# EAGLE design Papilio-VGA_Wing (EAGLE 6.4)
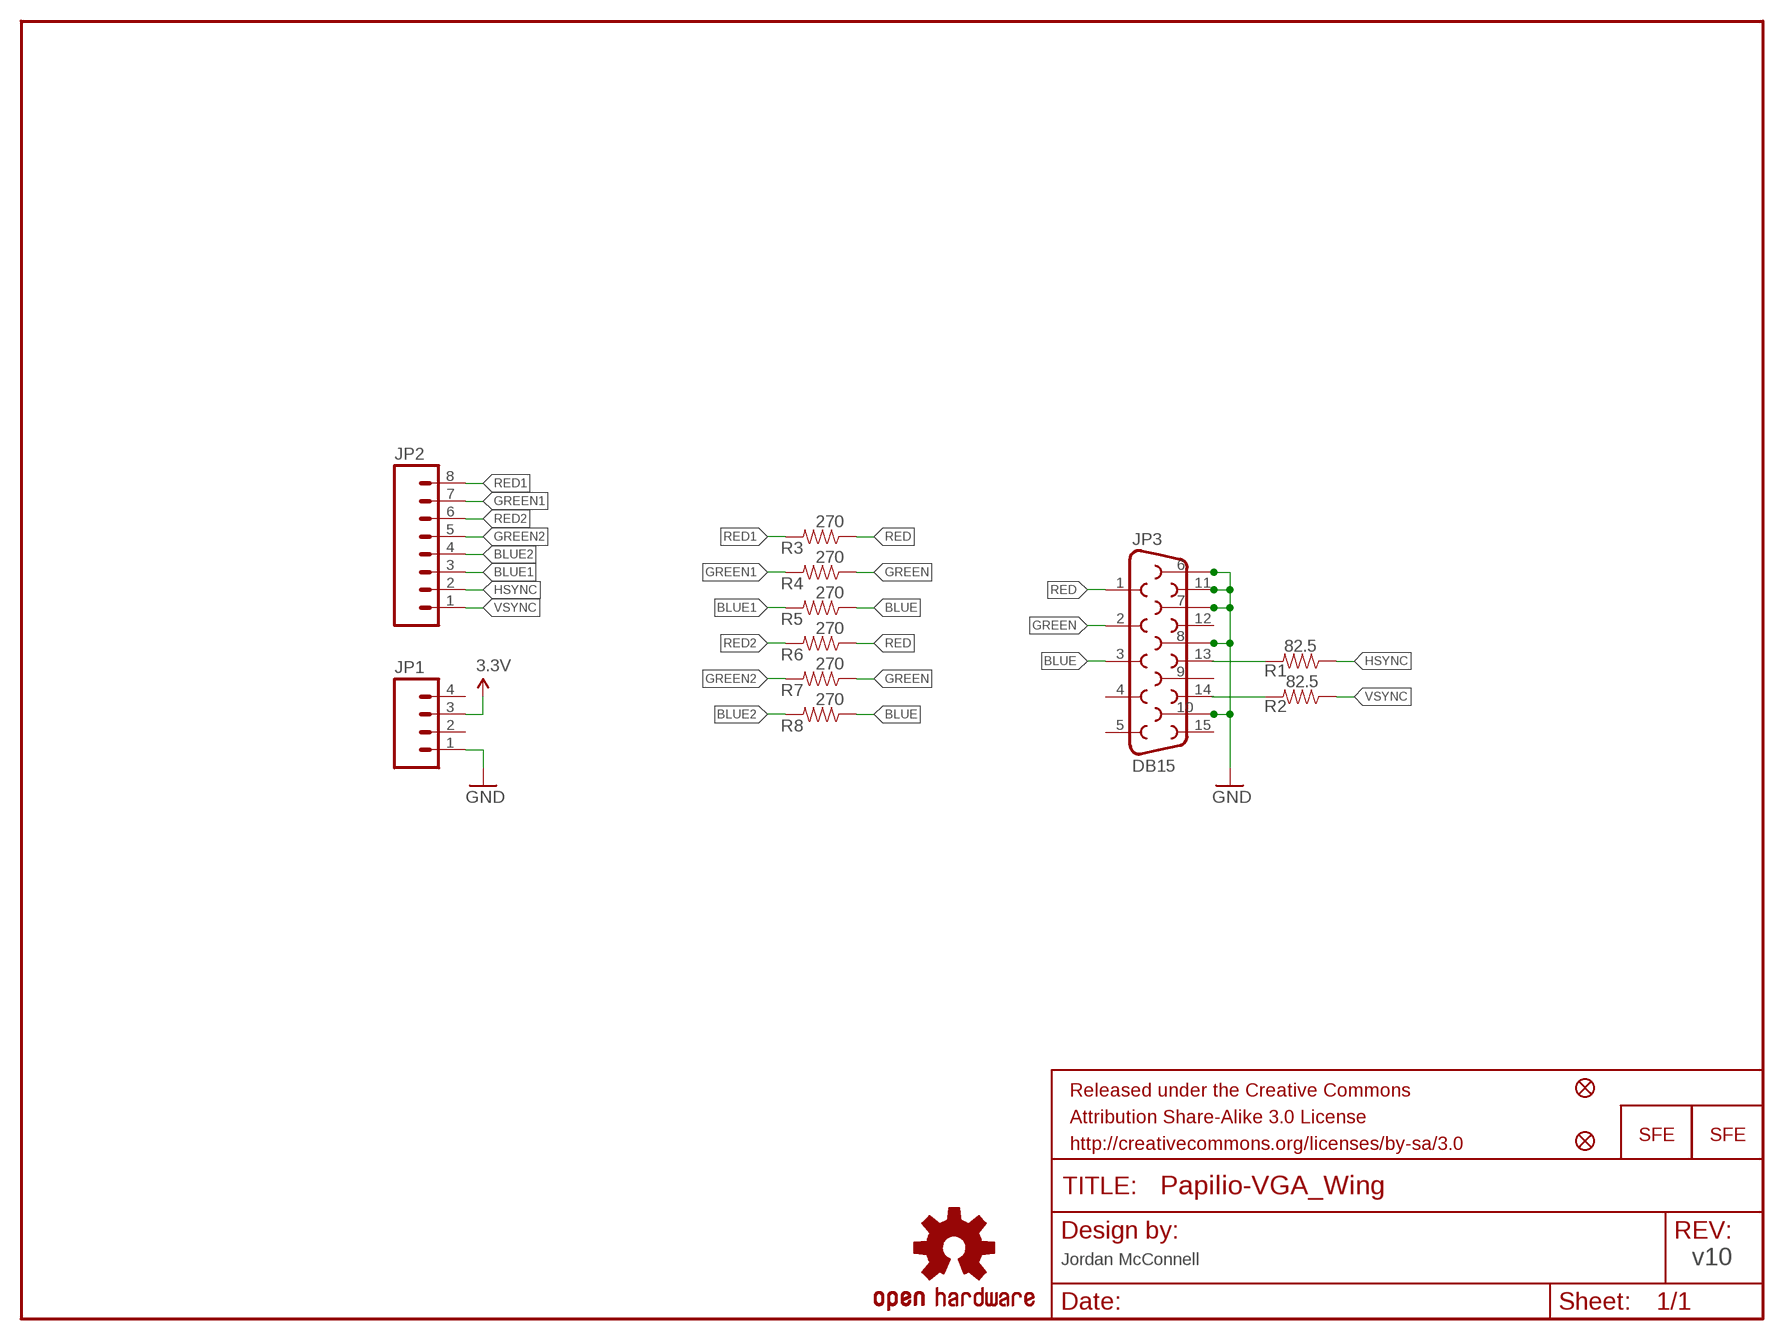
[diagram p0: schematic, sheet 1]

## Parts
FRAME1  FRAME-LETTER  [CREATIVE_COMMONS]
JP1  M04PTH  [1X04]
JP2  M081X08  [1X08]
JP3  DB15  [DB15]
JP4  FIDUCIALUFIDUCIAL  [MICRO-FIDUCIAL]
JP5  FIDUCIALUFIDUCIAL  [MICRO-FIDUCIAL]
JP6  LOGO-SFENEW  [SFE-NEW-WEBLOGO]
JP7  LOGO-SFESK  [SFE-LOGO-FLAME]
R1  82.5  RESISTOR0402-RES  [0402-RES]
R2  82.5  RESISTOR0402-RES  [0402-RES]
R3  270  RESISTOR0402-RES  [0402-RES]
R4  270  RESISTOR0402-RES  [0402-RES]
R5  270  RESISTOR0402-RES  [0402-RES]
R6  270  RESISTOR0402-RES  [0402-RES]
R7  270  RESISTOR0402-RES  [0402-RES]
R8  270  RESISTOR0402-RES  [0402-RES]
U$1  OSHW-LOGOS  [OSHW-LOGO-S]

## Nets
3.3V: JP1.3
BLUE: JP3.3 R5.1 R8.1
BLUE1: JP2.3 R5.2
BLUE2: JP2.4 R8.2
GND: JP1.1 JP3.6 JP3.7 JP3.8 JP3.10 JP3.11
GREEN: JP3.2 R4.1 R7.1
GREEN1: JP2.7 R4.2
GREEN2: JP2.5 R7.2
HSYNC: JP2.2 R1.1
N$2: JP3.13 R1.2
N$3: JP3.14 R2.2
RED: JP3.1 R3.1 R6.1
RED1: JP2.8 R3.2
RED2: JP2.6 R6.2
VSYNC: JP2.1 R2.1
Unconnected: JP1.2 JP1.4 JP3.4 JP3.5 JP3.9 JP3.12 JP3.15

## Notes on the sheet
- Jordan McConnell | v10

## Library data of the parts
FRAME1 = SparkFun-Aesthetics:FRAME-LETTER: Schematic Frame Standard 8.5x11 US Letter frame
JP1 = SparkFun-Connectors:M04: Header 4 Standard 4-pin 0.1" header. Use with straight break away headers (SKU : PRT-00116), right angle break away headers (PRT-00553), swiss pins (PRT-00743), machine pins (PRT-00117), and female headers (PRT-00115). Molex polarized connector foot print use with SKU : PRT-08231 with associated crimp pins and housings. 1MM SMD Version SKU: PRT-10208
JP2 = SparkFun-Connectors:M08: Header 8 Standard 8-pin 0.1" header. Use with straight break away headers (SKU : PRT-00116), right angle break away headers (PRT-00553), swiss pins (PRT-00743), machine pins (PRT-00117), and female headers (PRT-00115).
JP3 = SparkFun-Connectors:DB15: DB15 / VGA right angle through-hole female connector.
JP4 JP5 = SparkFun:FIDUCIAL: Fiducial Alignment Points Various fiducial points for machine vision alignment.
JP6 JP7 = SparkFun-Aesthetics:LOGO-SFE: Spark Fun Electronics PCB Logo This is the standard Spark Fun Electronics PCB logo.
R1-R8 = SparkFun-Passives:RESISTOR: Resistor Basic schematic elements and footprints for 0603, 1206, and PTH resistors.
U$1 = SparkFun-Aesthetics:OSHW-LOGO: Open Source Hardware Logo This logo indicates the piece of hardware it is found on incorporates a OSHW license and/or adheres to the definition of open source hardware found here: http://freedomdefined.org/OSHW

## Board
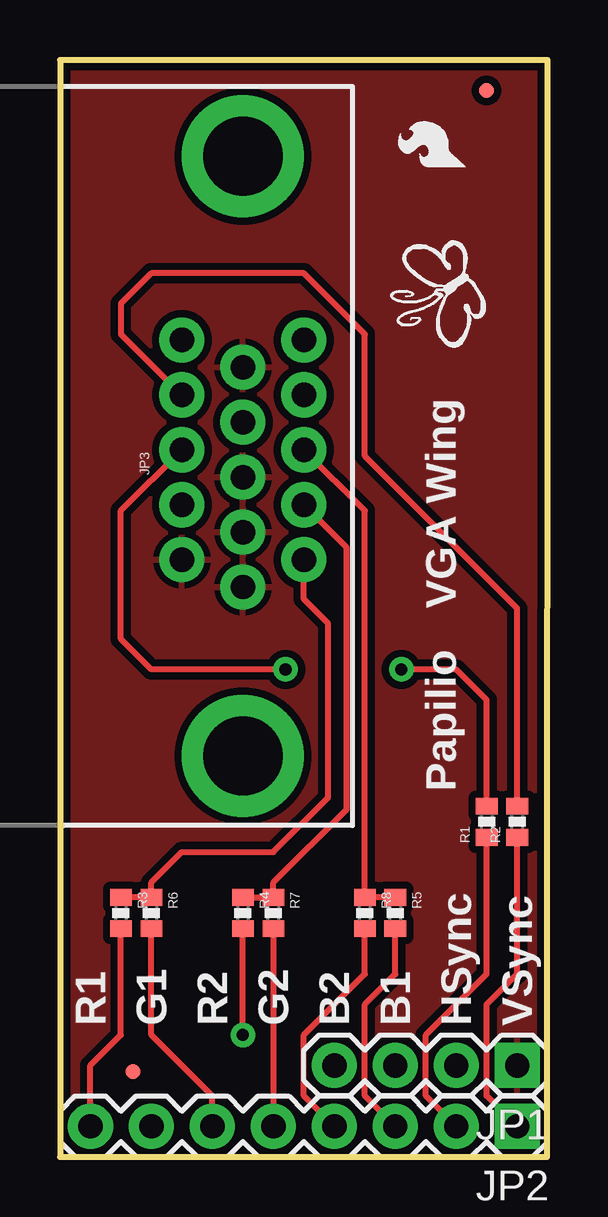
[diagram p1: board, top side]
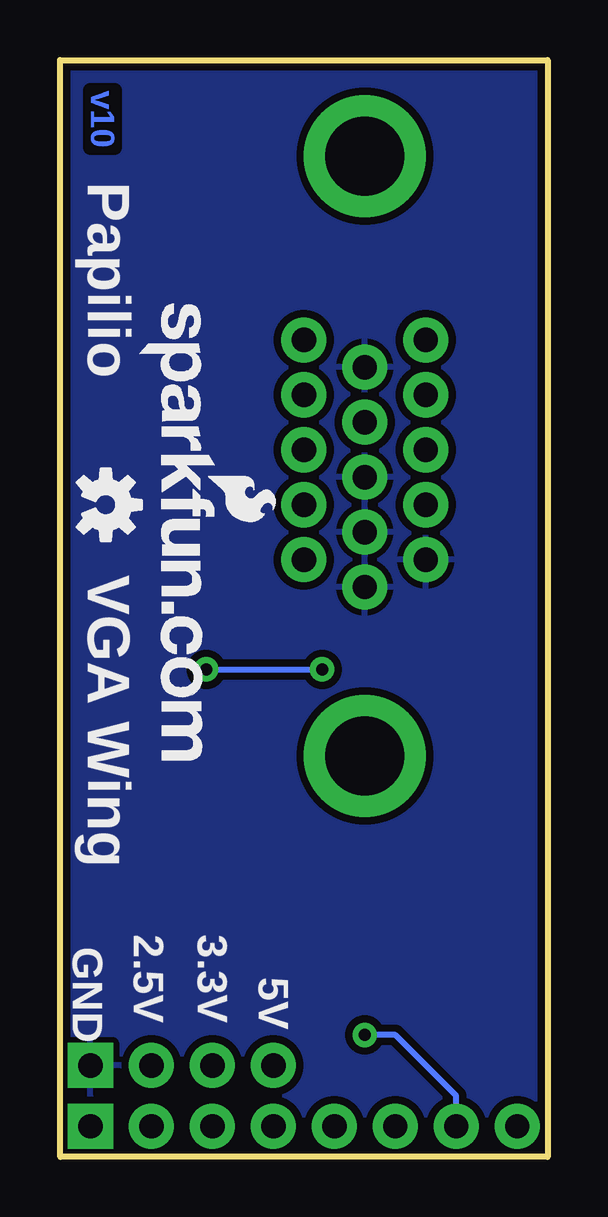
[diagram p2: board, bottom side, seen from below]

Size 20.32 x 45.72 mm. Coordinates in mm from the lower left corner, seen from the top.
Outline: 0,0 20.3,0 20.32,45.72 0,45.72 0,0
Copper layers (1*16): Top 0.035mm / dielectric 1.5mm / Bottom 0.035mm
Design rules "default": minimum track width 8mil, minimum drill 20mil, track to track 8mil, track to pad 8mil, pad to pad 8mil, via to via 8mil, smd to smd 8mil, copper to edge 8mil, drill to drill 8mil, minimum pad ring 12mil, minimum via ring 10mil, stop-mask expansion 4mil, vias tented up to drill 20mil, thermal gap 10mil

### Footprints (pad centres in the part's own frame; a part is rotated, then mirrored left to right if it is on the bottom)
1X04 = drill 1.016 pad 1.88 square: 1 0,0 | drill 1.016 pad 1.88: 2 2.54,0; 3 5.08,0; 4 7.62,0
1X08 = drill 1.016 pad 1.88 square: 1 0,0 | drill 1.016 pad 1.88: 2 2.54,0; 3 5.08,0; 4 7.62,0; 5 10.16,0; 6 12.7,0; 7 15.24,0; 8 17.78,0
DB15 = drill 1.016 pad 1.88: 1 -4.32,-7.62; 2 -2.03,-7.62; 3 0.26,-7.62; 4 2.55,-7.62; 5 4.84,-7.62; 6 -5.46,-5.08; 7 -3.17,-5.08; 8 -0.88,-5.08; 9 1.41,-5.08; 10 3.7,-5.08; 11 -4.32,-2.54; 12 -2.03,-2.54; 13 0.26,-2.54; 14 2.55,-2.54; 15 4.84,-2.54 | drill 3.302 pad 5.08: G1 -12.5,-5.08; G2 12.5,-5.08
MICRO-FIDUCIAL = smd 0.635 x 0.635: 1 0,0
0402-RES = smd 0.7 x 0.9: 1 -0.65,0; 2 0.65,0

### Placement (x,y rotation side)
FRAME1  -3.81,-11.43 0 top  (outside the outline)
JP1  19.05,3.81 180 top
JP2  19.05,1.27 180 top
JP3  2.54,29.21 90 top
JP4  3.05,3.56 0 top
JP5  17.78,44.45 0 top
JP6  17.02,35.56 270 bottom
JP7  16.89,41.27 90 top
R1  17.78,13.97 90 top
R2  19.05,13.97 90 top
R3  2.54,10.16 270 top
R4  7.62,10.16 270 top
R5  13.97,10.16 270 top
R6  3.81,10.16 270 top
R7  8.89,10.16 270 top
R8  12.7,10.16 270 top
U$1  18.41,27.18 270 bottom

### Tracks (layer width: path | path; a pad name or v marks a point on that pad's centre or on a via)
BLUE
  Top 0.254: R5.1 R8.1 12.7,26.93 JP3.3
BLUE1
  Top 0.254: JP2.3 12.7,2.54 12.7,6.35 13.97,7.62 R5.2
BLUE2
  Top 0.254: JP2.4 10.16,2.54 10.16,5.08 12.7,7.62 R8.2
GND
  pour Top (isolate 0.305): 0,0 0,45.72 20.32,45.72 20.32,0
  pour Bottom (isolate 0.305): 0,0 0,45.72 20.32,45.72 20.32,0
GREEN
  Top 0.254: R4.1 R7.1 8.89,11.43 11.94,14.48 11.94,25.4 JP3.2
GREEN1  (via drill 0.51)
  Top 0.254: v7.62,5.08 R4.2
  Bottom 0.254: JP2.7 3.81,2.54 6.35,5.08 v7.62,5.08
GREEN2
  Top 0.254: R7.2 JP2.5
HSYNC
  Top 0.254: JP2.2 15.24,2.54 15.24,5.08 17.78,7.62 R1.1
N$2  (via drill 0.51)
  Top 0.254: R1.2 17.78,19.05 16.51,20.32 v14.22,20.32 | JP3.13 2.54,26.93 2.54,21.59 3.81,20.32 v9.4,20.32
  Bottom 0.254: v14.22,20.32 v9.4,20.32
N$3
  Top 0.254: R2.2 19.05,22.86 12.7,29.21 12.7,34.29 10.16,36.83 3.81,36.83 2.54,35.56 2.54,34.29 JP3.14
RED
  Top 0.254: R3.1 R6.1 3.81,11.43 5.08,12.7 8.89,12.7 11.18,14.99 11.18,22.23 10.16,23.24 JP3.1
RED1
  Top 0.254: JP2.8 1.27,3.81 2.54,5.08 R3.2
RED2
  Top 0.254: JP2.6 6.35,2.54 3.81,5.08 R6.2
VSYNC
  Top 0.254: JP2.1 17.78,2.54 17.78,6.35 19.05,7.62 R2.1

### Text on the board
Bottom: v10
tPlace: VGA Wing | Papilio | R1 | G1 | R2 | G2 | B2 | B1 | HSync | VSync
bPlace: Papilio | VGA Wing | 3.3V | 2.5V | GND | 5V
tValues: Jordan McConnell